# Altium schematic sheet BoardA-Power.SchDoc
size A; SheetNumber: 1; SheetTotal: 9
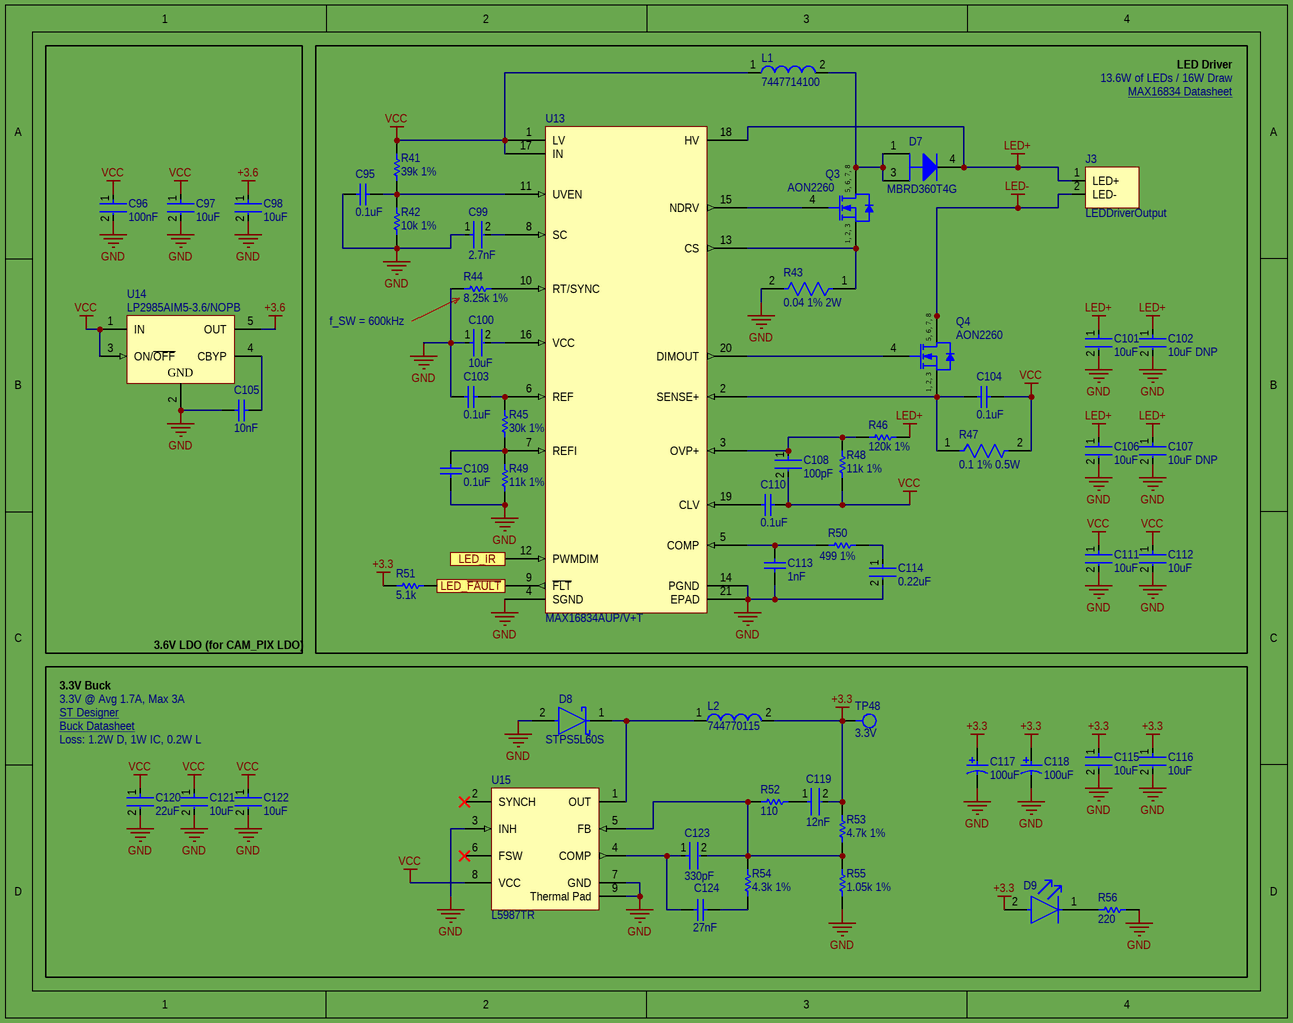
[diagram p0: BoardA-Power.SchDoc]

## Parts
C95  0.1uF  [CAPC2013X135X45ML10T25]
C96  100nF  [FP-CGA3E-0_3-0_1-IPC_A]
C97  10uF  [FP-C3225-250-0_4-MFG]
C98  10uF  [FP-C3225-250-0_4-MFG]
C99  2.7nF  [FP-GCM188-0_1-MFG]
C100  10uF  [FP-GRM32-MFG]
C101  10uF  [FP-GRM32-MFG]
C102  10uF DNP  [FP-GRM32-MFG]
C103  0.1uF  [CAPC2013X135X45ML10T25]
C104  0.1uF  [CAPC2013X135X45ML10T25]
C105  10nF  [CAPC1608X90X35ML10T15]
C106  10uF  [FP-GRM32-MFG]
C107  10uF DNP  [FP-GRM32-MFG]
C108  100pF  [FP-C0402-BB-MFG]
C109  0.1uF  [CAPC2013X135X45ML10T25]
C110  0.1uF  [CAPC2013X135X45ML10T25]
C111  10uF  [FP-GRM32-MFG]
C112  10uF  [FP-GRM32-MFG]
C113  1nF  [CAPC1608X90X35NL10T15]
C114  0.22uF  [FP-GRM188-0_1-e0_2_0_5-IPC_C]
C115  10uF  [FP-C3225-250-0_4-MFG]
C116  10uF  [FP-C3225-250-0_4-MFG]
C117  100uF  [CAPMP6032X28-T_V]
C118  100uF  [CAPMP6032X28-T_V]
C119  12nF  [FP-C0603C-CF-MFG]
C120  22uF  [FP-C4532-250-0_4-IPC_B]
C121  10uF  [FP-C3225-250-0_4-MFG]
C122  10uF  [FP-C3225-250-0_4-MFG]
C123  330pF  [FP-CC0603-DA-MFG]
C124  27nF  [CAPC1608X90X35NL10T15]
D7  MBRD360T4G  [ONSC-DPAK-3-369C-01_V]
D8  STPS5L60S  [FP-STPS5L60S-MFG]
D9  SML-D12U1WT86  [FP-SML-D12-MFG]  (value not drawn)
J3  LEDDriverOutput  [LEDDriverOutput]
L1  7447714100  [WE-PD 1050]
L2  744770115  [WE-PD-XL]
Q3  AON2260  [INF-PG-TDSON-8-1_V]
Q4  AON2260  [INF-PG-TDSON-8-1_V]
R41  39k 1%  [RESC1608X55X30NL15T15]
R42  10k 1%  [RESC1609X55X30LL15T15]
R43  0.04 1% 2W  [FP-CSRN2512-IPC_C]
R44  8.25k 1%  [RESC1608X55X30LL15T15]
R45  30k 1%  [RESC1608X55X30ML15T15]
R46  120k 1%  [RESC1609X55X30ML15T15]
R47  0.1 1% 0.5W  [FP-CSR1206-IPC_C]
R48  11k 1%  [RESC1608X55X30LL15T15]
R49  11k 1%  [RESC1608X55X30LL15T15]
R50  499 1%  [RESC1608X55X30NL15T15]
R51  5.1k  [RESC1005X40X25NL05T10]
R52  110  [RESC1608X55X30ML20T20]
R53  4.7k 1%  [RESC1608X55X30NL15T15]
R54  4.3k 1%  [RESC1609X50X30ML10T20]
R55  1.05k 1%  [RESC1608X55X30ML15T15]
R56  220  [RESC1005X40X25LL05T05]
TP48  3.3V  [TestPoint1mm]
U13  MAX16834AUP/V+T  [MAX16834AUPV+T]
U14  LP2985AIM5-3.6/NOPB  [MF05A_M]
U15  L5987TR  [VFQFPN8_M]

## Blocks framed on the sheet
3.6V LDO (for CAM_PIX LDO): C96-C98 C105 U14

## Ports
LED_IR (in), LED_~{FAULT} (out)

## Nets
+3.3: C115.1 C116.1 C117.1 C118.1 C119.2 D9.2(A) L2.2 R51.1 R53.2 TP48.1
+3.6: C98.1 U14.5(OUT)
GND: C95.1 C96.2 C97.2 C98.2 C99.1 C100.1 C101.2 C102.2 C103.1 C105.2 C106.2 C107.2 C109.2 C111.2 C112.2 C113.1 C114.2 C115.2 C116.2 C117.2 C118.2 C120.2 C121.2 C122.2 D8.2(A) R42.1 R43.2 R44.1 R49.2 R55.1 R56.2 U13.4(SGND) U13.14(PGND) U13.21(EPAD) U14.2(GND) U15.3(INH) U15.7(GND) U15.9(Thermal_Pad)
LED+: C101.1 C102.1 C106.1 C107.1 D7.4(K) J3.1(LED+) R46.2 U13.18(HV)
LED-: J3.2(LED-) Q4.5(DRAIN) Q4.6(DRAIN) Q4.7(DRAIN) Q4.8(DRAIN)
VCC: C96.1 C97.1 C104.2 C108.2 C110.2 C111.1 C112.1 C120.1 C121.1 C122.1 L1.1 R41.2 R47.2 R48.1 U13.1(LV) U13.17(IN) U14.1(IN) U14.3(ON/~{OFF}) U15.8(VCC)
LED_~{FAULT}: R51.2 U13.9(~{FLT}) ; port LED_~{FAULT}
LED_IR: U13.12(PWMDIM) ; port LED_IR
NetC95_2: C95.2 R41.1 R42.2 U13.11(UVEN)
NetC99_2: C99.2 U13.8(SC)
NetC100_2: C100.2 U13.16(VCC)
NetC103_2: C103.2 R45.2 U13.6(REF)
NetC104_1: C104.1 Q4.1(SOURCE) Q4.2(SOURCE) Q4.3(SOURCE) R47.1 U13.2(SENSE+)
NetC105_1: C105.1 U14.4(CBYP)
NetC108_1: C108.1 R46.1 R48.2 U13.3(OVP+)
NetC109_1: C109.1 R45.1 R49.1 U13.7(REFI)
NetC110_1: C110.1 U13.19(CLV)
NetC113_2: C113.2 R50.1 U13.5(COMP)
NetC114_1: C114.1 R50.2
NetC119_1: C119.1 R52.2
NetC123_1: C123.1 C124.2 U15.4(COMP)
NetC123_2: C123.2 R52.1 R53.1 R54.2 R55.2 U15.5(FB)
NetC124_1: C124.1 R54.1
NetD7_1: D7.1(A) D7.3(A) L1.2 Q3.5(DRAIN) Q3.6(DRAIN) Q3.7(DRAIN) Q3.8(DRAIN)
NetD8_1: D8.1(C) L2.1 U15.1(OUT)
NetD9_1: D9.1(C) R56.1
NetQ3_1: Q3.1(SOURCE) Q3.2(SOURCE) Q3.3(SOURCE) R43.1 U13.13(CS)
NetQ3_4: Q3.4(GATE) U13.15(NDRV)
NetQ4_4: Q4.4(GATE) U13.20(DIMOUT)
NetR44_2: R44.2 U13.10(RT/SYNC)

Not connected (* = marked no-connect by the designer): U15 2(SYNCH)* 6(FSW)*

## Notes on the sheet
- LED Driver
- 13.6W of LEDs / 16W Draw
- MAX16834 Datasheet <https://datasheets.maximintegrated.com/en/ds/MAX16834.pdf>
- f_SW = 600kHz
- 3.3V Buck
- 3.3V @ Avg 1.7A, Max 3A
- ST Designer <https://eds.st.com/dcdc/>
- Buck Datasheet <https://www.mouser.com/datasheet/2/389/cd00208518-1796746.pdf>
- Loss: 1.2W D, 1W IC, 0.2W L
- (in symbol CMP-1091-00061-1) 5, 6, 7, 8; 1, 2, 3

## Library data of the parts
C95 C103 C104 C109 C110 = CMP-2100-03644-1: Chip Capacitor, 0.1 uF, +/- 10%, 50 V, -55 to 125 degC, 0805 (2012 Metric), RoHS, Tape and Reel; Manufacturer: Murata; Voltage: 50V; Capacitance: 100nF; Insulation Resistance: 10GR; Dielectric Material: Ceramic; Dielectric: X7R; Package Description: 2-Pin Surface Mount Device, Body 2 x 1.25 mm; Manufacturer URL: http://www.murata.com/; Case Code (Imperial): 0805; Datasheet URL: http://psearch.en.murata.com/capacitor/product/GRM21BR71H104KA01%23.pdf; Termination: SMD/SMT; Lead Free: LeadFree; Package Quantity: 1; Mount: SurfaceMount; REACH SVHC: Unknown; Thickness: 0.053inch; Height: 1.25mm; Case/Package: 0805; Voltage Rating: 50V; Width: 0.049inch; Case Code (Metric): 2012; Material: Ceramic; Min Operating Temperature: -55degC; RoHSCompliant: true; Datasheet Version: 42675.0; Voltage Rating (DC): 50V; Tolerance: 10%; Package Reference: 0805; Depth: 1.25mm; Length: 2mm; Max Operating Temperature: 125degC; Packaging: TapeandReel; Number of Pins: 2; Radiation Hardening: No
C96 = CMP-2000-07546-2: Cap Ceramic 100nF 50V X7R 10% Pad SMD 0603 +125°C Automotive T/R; Weight: 7.1E-05oz; Composition: Ceramic; Max Operating Temperature: 125°C; Termination: SMD/SMT; Dielectric: X7R; Length: 1.6mm; Package Quantity: 1; REACH SVHC: No SVHC; Lead Free: Lead Free; Case Code (Metric): 1608; Min Operating Temperature: -55°C; Packaging: Tape and Reel; Tolerance: 10%; Voltage Rating: 50V; Case Code (Imperial): 0603; Capacitance: 100nF; Case/Package: 0603; Voltage Rating (DC): 50V; Depth: 0.8mm; Radiation Hardening: No; Ratings: AEC-Q200; Mount: Surface Mount; Voltage: 50V; Thickness: 0.035inch; Width: 0.8mm; Height: 0.8mm
C97 C98 C115 C116 C121 C122 = CMP-08246-002653-1: Multilayer Ceramic Capacitors 10uF ±20% 50V X7R SMD 1210; Width: 0.098inch; Package Quantity: 1000; Height: 2.5mm; Dielectric Material: Ceramic; Voltage Rating: 50V; Series: C; Capacitance: 10uF; Tolerance: 20%; Weight: 0.000564oz; Case/Package: 1210; Case Code (Imperial): 1210; Dielectric: X7R; Case Code (Metric): 3225; REACH SVHC: No SVHC; Packaging: Tape and Reel; Length: 0.126inch; Termination: SMD/SMT; Min Operating Temperature: -55°C; Voltage Rating (DC): 50V; Lead Free: Lead Free; Max Operating Temperature: 125°C; Thickness: 0.11inch; Mount: Surface Mount
C99 = CMP-2006-02319-2: Ceramic Capacitor for Automotive 2.7nF  ±5% 50VDC C0G 0603 Paper T/R; Voltage Rating: 50V; Length: 1.6mm; Radiation Hardening: No; Package Quantity: 4000; Ratings: AEC-Q200; Packaging: Tape and Reel; Capacitance: 2.7nF; Termination: SMD/SMT; Case Code (Metric): 1608; Case/Package: 0603; Dielectric: C0G; Tolerance: 5%; Max Operating Temperature: 125°C; Min Operating Temperature: -55°C; Mount: Surface Mount; Width: 0.031inch; Case Code (Imperial): 0603; Voltage Rating (DC): 50V; Depth: 0.8mm; Height: 0.8mm; Thickness: 0.035inch
C100-C102 C106 C107 C111 C112 = CMP-2000-05261-2: CAP CER 10UF 50V X7R 1210; Manufacturer Part Number: GRM32ER71H106KA12L; Manufacturer: Murata; Tolerance: 10%; Material: Ceramic; Temperature Coefficient: 15%; Voltage Rating: 50V; Temperature Characteristic: X7R; Value: 10uF; ComponentLink2Description: Datasheet; Device Class L1: Passive Components; Lead Free: Yes; Temperature Range High: +125°C; Category: Cap; ComponentLink2URL: https://search.murata.co.jp/Ceramy/image/img/A01X/G101/ENG/GRM32ER71H106KA12-01.pdf; Device Class L2: Capacitors; Package: GRM32; Mouser Description: 1210 10 uF 50 V ±10% Tolerance X7R SMT Multilayer Ceramic Capacitor; Capacitance: 10uF; Octopart: https://octopart.com/grm32er71h106ka12l-murata-10470987; Digikey Description: CAP CER 10UF 50V X7R 1210; Height: 2.7mm; Temperature: -55°C to +125°C; Temperature Range Low: -55°C; RoHS: TRUE; Device Class L3: Ceramic Capacitors; Automotive: No
C105 = CMP-2100-03642-1: Chip Capacitor, 10 nF, +/- 10%, 50 V, -55 to 125 degC, 0603 (1608 Metric), RoHS, Tape and Reel; Manufacturer: Murata; Insulation Resistance: 10GR; Dielectric: X7R; Voltage Rating: 50V; Material: Ceramic; Package Quantity: 1; Lead Free: LeadFree; Case/Package: 0603; Termination: SMD/SMT; REACH SVHC: Unknown; Manufacturer URL: http://www.murata.com/; Datasheet URL: http://search.murata.co.jp/Ceramy/image/img/A01X/G101/ENG/GRM188R71H103KA01-01.pdf; Mount: SurfaceMount; Datasheet Version: 42401.0; Number of Pins: 2; Length: 1.6mm; Voltage: 50V; Depth: 0.8mm; Tolerance: 10%; Min Operating Temperature: -55degC; Voltage Rating (DC): 50V; Max Operating Temperature: 125degC; Package Description: 2-Pin Surface Mount Device, Body 1.6 x 0.8 mm; RoHSCompliant: True; Case Code (Imperial): 0603; Width: 0.031inch; Case Code (Metric): 1608; Height: 0.8mm; Package Reference: 0603; Packaging: TapeandReel; Thickness: 0.035inch; Capacitance: 10nF; Dielectric Material: Ceramic
C108 = CMP-2008-03301-2: CAP CER 100PF 100V NP0 0402; Manufacturer: Kemet; Manufacturer Part Number: C0402C101J1GACTU; Material: Ceramic; Tolerance: 0.05; Temperature Coefficient: 15%; Temperature Characteristic: C0G; Device Class L3: Ceramic Capacitors; Category: Cap; Ipc Land Pattern Name: CAPC10050X50; Lead Free: Yes; Height: 0.55mm; Temperature Range Low: -55°C; ComponentLink2Description: Datasheet; Value: 100 pF; Temperature: -55°C to +125°C; Digikey Description: CAP CER 100PF 100V NP0 0402; Voltage Rating: 100 V; ComponentLink2URL: https://content.kemet.com/datasheets/KEM_C1002_X7R_SMD.pdf; Octopart: https://octopart.com/c0402c101j1gactu-kemet-12592160; Device Class L2: Capacitors; RoHS: TRUE; Mouser Description: Cap Ceramic 100pF 100V C0G 5% SMD 0402 125°C Paper T/R; Package: C0402-BB; Automotive: No; Device Class L1: Passive Components; Capacitance: 100 pF; Temperature Range High: +125°C
C113 = CMP-2006-02891-1: Part Number: GRM188R71H102KA01D; Manufacturer: Murata
C114 = CMP-1035-02648-3: Chip Multilayer Ceramic Capacitors for General Purpose, 0603, 0.22uF, X7R, 15%, 10%, 25V; Voltage: 50V; Capacitance: 220nF; Number of Pins: 2; Length: 1.6mm; Material: Ceramic; Depth: 0.8mm; REACH SVHC: No SVHC; Voltage Rating (DC): 25V; Tolerance: 10%; Max Operating Temperature: 125°C; Lead Free: Lead Free; Package Quantity: 1; Voltage Rating: 25V; Width: 0.8mm; Case Code (Metric): 1608; Min Operating Temperature: -55°C; Case/Package: 0603; Mount: Surface Mount; Dielectric: X7R; Height: 0.8mm; Termination: SMD/SMT; Radiation Hardening: No; Case Code (Imperial): 0603; Thickness: 0.035inch; Packaging: Tape and Reel
C117 C118 = CMP-2000-07294-1: Low ESR, 100 uF, 10 V, +/- 10%, -55 to 125 degC, 2-Pin SMD, RoHS, Tape and Reel; Manufacturer: AVX; DELETED: Compliant; Voltage: 10VDC; Rad Hardened: No; Polarity: Polar; Wire Form: NotRequired; Case Style: Molded; Product Length (mm): 6mm; DF: 8%; ESR: 0.1ohm; Product Diameter (mm): NotRequiredmm; Product Height (mm): 2.6mm; DCL: 10uA; Capacitance: 100000000pF; Product Depth (mm): 3.2mm; Tolerance (+ or -): 10%; Mounting Technology: SurfaceMount; Failure Rate: NotRequired; Mounting Style: SurfaceMount; Packaging: TapeandReel; Construction: SMTChip; Datasheet Version: 01/2017; Manufacturer URL: http://www.avx.com/; Case Code: C; Datasheet URL: http://datasheets.avx.com/TPS.pdf; Operating Temp Range: -55Cto125C; Package Description: 2-Pin Surface Mount Device, Body 6 x 3.25 mm; Seated Plane Height: NotRequiredmm; Length W/Weld (max): NotRequiredmm; Package URL: http://www.avx.com/download/software/literature/AVX-Footprint-Library.pdf; Package Reference: CAPMP06032X28-T; Length W/Weld: NotRequiredmm; Insulation: NotRequired; Lead Spacing (nom): NotRequiredmm; Package / Case: 6032-28; Seal: NotRequired
C119 = CMP-2006-02245-2: CAP CER 0.012UF 50V 10% X7R 0603; Manufacturer: KEMET; Manufacturer Part Number: C0603C123K5RACTU; Value: 12,000 pF; Automotive Grade: Grade 1; Material: Ceramic; Tolerance: 0.1; Temperature Coefficient: 30ppm/°C; Category: Cap; Height: 0.87mm; Lead Free: Yes; Temperature: -55°C to +125°C; Device Class L2: Capacitors; RoHS: TRUE; Capacitance: 12,000 pF; Mouser Description: Multilayer Ceramic Capacitors MLCC - SMD/SMT 50volts 12000pF X7R 10%; Temperature Range Low: -55°C; Temperature Range High: +125°C; Temperature Characteristic: X7R; Device Class L1: Passive Components; Package: C0603C-CF; Voltage Rating: 50 V; Octopart: https://octopart.com/c0603c123k5ractu-kemet-9143719; Device Class L3: Ceramic Capacitors; ComponentLink2URL: https://api.kemet.com/component-edge/download/datasheet/C0603C100J5GACAUTO.pdf; Automotive: Yes; ComponentLink2Description: Datasheet; Digikey Description: CAP CER 0.012UF 50V 10% X7R 0603
C120 = CMP-08246-004073-1: Multilayer Ceramic Capacitors 22uF ±20% 25V X5R SMD 1812; Weight: 0.000952oz; RoHS Compliant: Yes; Construction: Flat; Max Operating Temperature: 85°C; Case Code (Metric): 4532; REACH SVHC: No SVHC; Tolerance: 20%; Number of Pins: 2; Package Quantity: 1; Mount: Surface Mount; Min Operating Temperature: -55°C; Voltage Rating (DC): 25V; Radiation Hardening: No; Capacitance: 22uF; Width: 0.126inch; Case/Package: 1812; Dielectric: X5R; Voltage Rating: 25V; Height: 2.5mm; Length: 4.5mm; Lead Free: Lead Free; Thickness: 0.11inch; Depth: 3.2mm; Voltage: 25V; Dielectric Material: Ceramic; Termination: SMD/SMT; Packaging: Tape and Reel; Case Code (Imperial): 1812; Resistor Type: Ceramic; Series: C
C123 = CMP-03422-000084-1: CAP CER 330PF 50V X7R 0603; Manufacturer Part Number: CC0603KRX7R9BB331; Manufacturer: YAGEO; Tolerance: 0.1; Temperature Coefficient: 15%; Material: Ceramic; Voltage Rating: 50 V; Temperature Characteristic: X7R; RoHS: TRUE; Height: 0.9mm; Voltage: 50 V; Package: CC0603-DA; Category: Cap; Automotive: No; Temperature Range Low: -55°C; Lead Free: Yes; Device Class L2: Capacitors; Device Class L1: Passive Components; ComponentLink2Description: Datasheet; Value: 330 pF; Capacitance: 330 pF; Temperature: -55°C to +125°C; Temperature Range High: +125°C; Mouser Description: CAP CER 330PF 50V X7R 0603; Octopart: https://octopart.com/cc0603krx7r9bb331-yageo-193039; Footprint Url: http://www.yageo.com/exep/pages/download/literatures/UPY-C_GEN_24.pdf; ComponentLink2URL: http://www.yageo.com/documents/recent/UPY-GPHC_X7R_6.3V-to-50V_18.pdf; Digikey Description: CAP CER 330PF 50V X7R 0603; Device Class L3: Ceramic Capacitors
C124 = CMP-2006-02878-1: Part Number: GRM188R71E273KA01D; Manufacturer: Murata
D7 = CMP-1055-00192-1: SWITCHMODE(TM) Power Rectifier, 3-Pin DPAK, Pb-Free, Tape and Reel; Manufacturer: On Semiconductor; Configuration: Single; IFSM Max (A): 75; Mounting Technology: Surface Mount; ComponentLink2Description: Datasheet; ComponentLink3URL: http://www.onsemi.cn/pub_link/Collateral/369C.PDF; DatasheetVersion: Rev. 8; ComponentLink2URL: http://www.onsemi.com/pub_link/Collateral/MBRD320-D.PDF; PackageDescription: 3-Pin Flange Mount, Body 6.54 x 6.095 mm, Pitch 2.29 mm; ComponentLink1URL: http://www.onsemi.com/; Packing: Tape and Reel; RoHS: TRUE; ComponentLink1Description: Manufacturer URL; ComponentLink3Description: Package Specification; PackageVersion: Rev. E, 02/2014; PackageReference: DPAK-3-369C-01; PartNumber: MBRD360T4G
D8 = CMP-12187-000009-2: DIODE SCHOTTKY 60V 5A SMC; Max Forward Surge Current (Ifsm): 150A; Max Reverse Leakage Current: 220uA; Forward Voltage: 520mV; Element Configuration: Single; Radiation Hardening: No; Package Quantity: 2500; REACH SVHC: No SVHC; Max Reverse Voltage (DC): 60V; Number of Pins: 2; Mount: Surface Mount; Height: 2.45mm; Forward Current: 5A; Packaging: Tape and Reel; Width: 6.25mm; Series: -; Peak Non-Repetitive Surge Current: 150A; Average Rectified Current: 5A; Max Surge Current: 150A; Case/Package: SMC; Lead Free: Lead Free; Max Repetitive Reverse Voltage (Vrrm): 60V; Min Operating Temperature: -65°C; RoHS Compliant: Yes; Length: 7.15mm; Max Reverse Current: 220uA; Max Operating Temperature: 150°C
D9 = CMP-08952-000009-1: LED RED DIFFUSED 1608 SMD; Manufacturer: Rohm; Led Orientation: Top View; Power Dissipation: 54mW; Forward Current: 20mA; Wavelength: 620nm; Reverse Voltage: 5V; Luminous Intensity: 63mcd; Forward Voltage: 2.2V; Mouser Description: SML-D12 Series Red 0603 Diffused 63 mcd 2.2 V Surface Mount LED; Temperature: -40°C to +85°C; Device Class L2: LEDs; Lead Free: Yes; Automotive: No; Octopart: https://octopart.com/sml-d12u1wt86-rohm-70850259; RoHS: TRUE; Colour: Red; Digikey Description: LED RED DIFFUSED 1608 SMD; Package: SML-D12; Device Class L1: Optoelectronics; Category: Diode; Temperature Range High: +85°C; Height: 0.65mm; ComponentLink2Description: Datasheet; Temperature Range Low: -40°C; ComponentLink2URL: https://www.rohm.com/datasheet/SML-D12U1W/sml-d12x1-e; Manufacturer Part Number: SML-D12U1WT86; Device Class L3: unset
J3 = LEDDriverOutput: Output pads from the LED Driver
L1 = CMP-1396-00035-1: SMD-Shielded Power Inductor WE-PD, L=10.0 µH; Manufacturer: Wuerth Elektronik; Inductance: 10.0 ÂµH; PackageReference: WE-PD 1050; ComponentLink2Description: Datasheet; ComponentLink1Description: Manufacturer URL; ComponentLink2URL: http://www.we-online.de/katalog/media/pdf/7447714100.pdf; PartNumber: 7447714100; ComponentLink1URL: http://www.we-online.com
L2 = CMP-0227-00202-1: SMD-Shielded Power Inductor WE-PD, L = 15.0 µH; Inductance: 15.0 ÂµH; PackageDescription: SMD Inductor, 2-Leads, Body 12.0 x 12.0 mm; ComponentLink2Description: Datasheet; PackageReference: WE-PD-XL; ComponentLink1URL: http://www.we-online.com; ComponentLink1Description: Manufacturer Link; DatasheetVersion: ver 5, Oct-2004; PackageVersion: 2004; ComponentLink2URL: http://www.we-online.de/katalog/media/pdf/744770115.pdf
Q3 Q4 = CMP-1091-00061-1: N-Channel OptiMOS 3 Power-Transistor, 80 V VDS, 23 A ID, -55 to 150 degC, PG-TDSON-8-1, Reel, Green; Manufacturer: Infineon; PartNumber: BSC340N08NS3 G; RDS (on) (max): 34Â mOhm; VGS(th) (min): 2Â V; QG: 6.8Â nC; Rth: 3.9Â K/W; ID (max): 23Â A; VDS (max): 80Â V; VGS(th) (max): 3.5Â V; Polarity: N; RthJA (max): 62 K/W; Green: TRUE; IDpuls (max): 92Â A; Ptot (max): 32Â W; ComponentLink1Description: Manufacturer URL; ComponentLink1URL: http://www.infineon.com/; Mounting Technology: Surface Mount; Halogen-free: TRUE; DatasheetVersion: Rev. 2.6; ComponentLink3Description: Package Specification; ComponentLink3URL: http://www.infineon.com/cms/packages/SMD_-_Surface_Mounted_Devices/P-PG-TDSON/P-PG-TDSON-08-01x_2x_3.html?__locale=en; PackageDescription: 8-Pin Plastic (Green) Thin Dual Small Outline Non-Leaded Package, 5.15 x 5.9 mm Body, 1.27 mm Pitch; ComponentLink2Description: Datasheet; RthJC (max): 3.9Â K/W; Packing: Reel; ComponentLink2URL: http://www.infineon.com/dgdl/BSC340N08NS3G_rev2.6.pdf?folderId=db3a304313b8b5a60113cee8763b02d7&fileId=db3a30431add1d95011ae81c21f2563a; PackageReference: PG-TDSON-8-1
R41 = CMP-2000-00476-1: Part Number: ERJ3EKF3902V; Manufacturer: Panasonic
R42 = CMP-1012-00623-3: Chip Resistor, 10 KOhm, +/- 1%, 0.1 W, -55 to 155 degC, 0603 (1608 Metric), RoHS, Tape and Reel; Manufacturer: Panasonic; Voltage Rating: 75V; Case\/Package: 0603; Power Rating: 100mW; Resistance: 10KOhm; Temperature Coefficient: 100ppm\/degreesC; Number of Pins: 2; Package Reference: 603; Depth: 0.8mm; Mount: SurfaceMount; Package Description: 2-Pin Surface Mount Device, Body 1.6 x 0.85 mm; Datasheet Version: 02/2017; Length: 1.6mm; Lead Free: LeadFree; Height: 0.45mm; Number of Terminations: 2; Max Power Dissipation: 100mW; Min Operating Temperature: -55degC; Datasheet URL: https://industrial.panasonic.com/cdbs/www-data/pdf/RDA0000/AOA0000C304.pdf; Termination: SMD/SMT; Case Code (Metric): 1608; Case Code (Imperial): 0603; Tolerance: 1%; Max Operating Temperature: 155degC; RoHSCompliant: true; Voltage Rating (DC): 75V; Radiation Hardening: No; Packaging: TapeandReel; Composition: ThickFilm; Mounting Technology: SurfaceMount; Manufacturer URL: http://www.panasonic.com/; Width: 0.031inch; REACH SVHC: NoSVHC; Contact Plating: Tin; Military Standard: Not; Package Quantity: 1
R43 = CMP-26527-002019-1: Res Thick Film 2512 40mΩ 1% 2W ±200ppm/°C Molded SMD Plastic T/R; Resistance: 40mR; Length: 0.25inch; RoHS Compliant: Yes; Number of Terminations: 2; Resistor Type: Thick Film; Packaging: Tape and Reel; Case Code (Imperial): 2512; Tolerance: 1%; Max Operating Temperature: 155°C; Min Operating Temperature: -55°C; Series: CSRN; Case Code (Metric): 6432; Max Power Dissipation: 2W; Lead Free: Lead Free; Case/Package: 2512; Width: 0.124inch; Height: 0.028inch; Mount: Surface Mount; Temperature Coefficient: 200ppm/°C
R44 = CMP-2000-00659-1: Manufacturer: Panasonic; Part Number: ERJ-3EKF8251V
R45 = CMP-2000-00413-1: Part Number: ERJ-3EKF3002V; Manufacturer: Panasonic
R46 = CMP-2000-00216-2: Chip Resistor, 120 KOhm, +/- 1%, 0.1 W, -55 to 155 degC, 0603 (1608 Metric), RoHS, Tape and Reel; Manufacturer: Panasonic; Voltage Rating (DC): 75V; Temperature Coefficient: 100ppm/degC; Max Power Dissipation: 100mW; Depth: 0.8mm; Min Operating Temperature: -55degC; Number of Terminations: 2; Case Code (Metric): 1608; Datasheet Version: 42095.0; Tolerance: 1%; Radiation Hardening: No; REACH SVHC: NoSVHC; Package Description: 2-Pin Surface Mount Device, Body 1.6 x 0.85 mm; Package URL: http://www.st.com/st-web-ui/static/active/en/resource/technical/document/datasheet/CD00001320.pdf; Number of Pins: 2; Height: 0.022inch; Voltage Rating: 75V; Datasheet URL: https://industrial.panasonic.com/cdbs/www-data/pdf/RDA0000/AOA0000C283.pdf; Composition: ThickFilm; Length: 1.6mm; Width: 0.8mm; Packaging: TapeandReel; Package Reference: 0603; Package Quantity: 1; Manufacturer URL: http://www.panasonic.com/; Mount: SurfaceMount; RoHSCompliant: True; Military Standard: Not; Contact Plating: Tin; Case/Package: 0603; Max Operating Temperature: 155degC; Resistance: 120KOhm; Power Rating: 100mW; Case Code (Imperial): 0603; Termination: SMD/SMT; Lead Free: LeadFree
R47 = CMP-26527-001750-1: General Purpose Thick Film Chip Resistor, 1206, 0.1Ω, 1%, 100ppm/°C, 0.5W; Max Power Dissipation: 500mW; Resistance: 100mR; Package Quantity: 1; Series: CSR; Military Standard: Not; Case Code (Imperial): 1206; Case/Package: 1206; Temperature Coefficient: 100ppm/°C; Max Operating Temperature: 155°C; Mount: Surface Mount; Lead Free: Lead Free; Number of Terminations: 2; Construction: Rectangular; Resistor Type: Thick Film; Min Operating Temperature: -55°C; Width: 0.061inch; Length: 0.12inch; RoHS Compliant: Yes; Depth: 1.55mm; Tolerance: 1%; Packaging: Tape and Reel; Contact Plating: Tin; Height: 0.026inch; Case Code (Metric): 3216; Radiation Hardening: No
R48 R49 = CMP-2000-00199-1: Part Number: ERJ-3EKF1102V; Manufacturer: Panasonic
R50 = CMP-2000-00534-1: Manufacturer: Panasonic; Part Number: ERJ-3EKF4990V
R51 = CMP-2002-07753-1: Part Number: RC0402FR-075K1L; Manufacturer: Yageo / Phycomp
R52 = CMP-2000-00881-1: Part Number: ERA-3AEB111V; Manufacturer: Panasonic
R53 = CMP-1012-00586-3: Precision Thick Film Chip Resistor, 4.7 KOhm, +/- 1%, -55 to 155 degC, 0603 (1608 Metric), RoHS, Tape and Reel; Resistance: 220 Ohm; Voltage Rating: 50 V; Elements: 4; Case\Package: 1205; Tolerance: 5%; Power Rating: 250 mW; PackageReference: 0603; Max Operating Temperature: 125 degC; REACH SVHC: No SVHC; Width: 0.063 inch; Length: 0.126 inch; Height: 0.024 inch; Mount: Surface Mount; Package Quantity: 1; DatasheetVersion: Apr-15; ComponentLink1Description: Manufacturer URL; Min Operating Temperature: -55 degC; Packaging: Tape and Reel; Radiation Hardening: No; ComponentLink2URL: http://industrial.panasonic.com/cdbs/www-data/pdf/RDA0000/AOA0000C86.pdf; Case Code (Metric): 3216; Pins: 8; Case Code (Imperial): 1206; Type (Resistor): Thick Film; RoHSCompliant: true; ComponentLink2Description: Datasheet; PackageDescription: 2-Pin Surface Mount Device, Body 1.6 x 0.85 mm; ComponentLink1URL: http://www.panasonic.com/
R54 = CMP-2000-03405-1: Manufacturer: Vishay Dale; Part Number: CRCW06034K30FKEA
R55 = CMP-2000-00188-1: Part Number: ERJ-3EKF1051V; Manufacturer: Panasonic
R56 = CMP-2002-00487-3: Chip Resistor, 220 Ohm, +/- 5%, 100 mW, -55 to 155 degC, 0402 (1005 Metric), RoHS, Tape and Reel; Manufacturer: Basic Passives; PartNumber: ERJ-2GEJ221X; Voltage Rating: 50 V; Case\/Package: 0402; Power Rating: 100 mW; Resistance: 220 Ohm; Mounting Technology: Surface Mount; Width: 0.5 mm; Package Quantity: 10000; REACH SVHC: Unknown; Height: 0.35 mm; PackageReference: 0402; PackageDescription: 2-Pin Surface Mount Device, Body 1 x 0.5 mm; Length: 1 mm; Max Operating Temperature: 155 degC; Tolerance: 5%; ComponentLink1Description: Manufacturer URL; Pins: 2; ComponentLink1URL: http://www.panasonic.com/; Min Operating Temperature: -55 degC; Case Code (Imperial): 0402; Mount: Surface Mount; Case Code (Metric): 1005; ComponentLink2URL: http://industrial.panasonic.com/cdbs/www-data/pdf/RDA0000/AOA0000C84.pdf; Packaging: Tape and Reel; ComponentLink2Description: Datasheet; DatasheetVersion: 04/2015; Radiation Hardening: No; RoHSCompliant: true
TP48 = TestPoint1mm: Test Point 1mm Diameter
U13 = MAX16834AUP/V+T: IC LED DRVR HIGH BRIGHT 20-TSSOP; Manufacturer: Maxim; Manufacturer Part Number: MAX16834AUP+; Max Power Dissipation: 2.122W; Number of Segments: 100; Operating Supply Voltage: 28V; Number of Outputs: 1; Max Supply Current: 6mA; Topology: SEPIC; Frequency: 1MHz; Output Current: 3A; Min Input Voltage: 4.75V; Supplier 1: Digi-Key; RoHS: Yes; Category: LED Drivers; Stock 1: 756; Pricing 1: 1=6.28000, 10=5.67600, 25=5.41200, 100=4.69920, 250=4.48800, 500=4.09200, 1000=3.96000 (USD); Mount: Surface Mount; Case/Package: TSSOP; Number of Pins: 20; Contact Plating: Tin,Matte; Min Operating Temperature: -40°C; Max Operating Temperature: 125°C; Package Quantity: 74; Packaging: Rail/Tube; Power Dissipation: 2.122W; Series: -; Max Input Voltage: 28V; Switching Frequency: 1MHz; Radiation Hardening: No; RoHS Compliant: Yes; REACH SVHC: Unknown; ComponentLink1URL: https://datasheet.ciiva.com/1946/max16834-1946936.pdf?src-supplier=Digi-Key; ComponentLink1Description: https://datasheet.ciiva.com/1946/max16834-1946936.pdf?src-supplier=Digi-Key; ComponentLink2URL: https://datasheet.ciiva.com/17300/max16834-17300234.pdf?src-supplier=Avnet+Europe; ComponentLink2Description: https://datasheet.ciiva.com/17300/max16834-17300234.pdf?src-supplier=Avnet+Europe; Supplier Part Number 1: MAX16834AUP+-ND; Supplier 2: Avnet; Stock 2: 60000; Pricing 2: 2500=4.44310, 5000=4.38030, 10000=4.31750, 15000=4.25470, 20000=4.19190, 25000=4.12910, 250000=4.06630 (USD); ComponentLink3URL: https://datasheet.ciiva.com/12277/max16834-97839-12277202.pdf?src-supplier=Mouser; ComponentLink3Description: https://datasheet.ciiva.com/12277/max16834-97839-12277202.pdf?src-supplier=Mouser; ComponentLink4URL: https://datasheet.ciiva.com/3163/max16834-3163925.pdf?src-supplier=Avnet; ComponentLink4Description: https://datasheet.ciiva.com/3163/max16834-3163925.pdf?src-supplier=Avnet; ComponentLink5URL: https://datasheet.ciiva.com/1948/max16834-1948686.pdf?src-supplier=Digi-Key; ComponentLink5Description: https://datasheet.ciiva.com/1948/max16834-1948686.pdf?src-supplier=Digi-Key; Supplier Part Number 2: MAX16834AUP/V+T
U14 = CMP-0062-02036-2: Micropower 150 mA Low-Noise Ultra Low-Dropout Regulator, 5-pin SOT-23, Pb-Free; Manufacturer: National Semiconductor; CompType: LDO IC; PackageTopMarking: L0SA*XTT; PowerWise: N; RoHS: Y; DatasheetVersion: Jul-2007; ComponentLink2Description: LP2985 Web Page; ComponentLink1Description: LP2985 Datasheet; ComponentLink3Description: MF05A Package Page; PackageVersion: revD, Aug-2008; ComponentLink2URL: http://www.national.com/pf/LP/LP2985.html; PinCount: 5; ComponentLink3URL: http://www.national.com/packaging/folders/mf05a.html; RevisionNote: Component URLs added; ComponentLink1URL: http://www.national.com/ds/LP/LP2985.pdf; PackageDescription: Molded SOT-23, .115 x .063 x .040 in Body, 5 Lead, .0375 in Pitch; PackageReference: MF05A
U15 = CMP-0240-00148-1: Up to 3 A step down switching regulator, 8-Pin VFQFPN, Tape and Reel; PackageReference: VFQFPN8; ComponentLink1Description: Manufacturer URL; PackageVersion: 2009; ComponentLink2Description: Datasheet; ComponentLink1URL: http://www.st.com; ComponentLink2URL: http://www.st.com/internet/com/TECHNICAL_RESOURCES/TECHNICAL_LITERATURE/DATASHEET/CD00208518.pdf; DatasheetVersion: Jun-2009; PackageDescription: 8-Pin VFQFPN, 3 x 3 x 1.08 mm Body, 0.5 mm Pitch, Exposed Pad